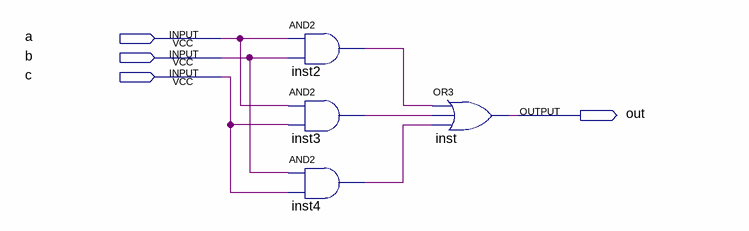
[diagram p0: schematic sheet]
// Quartus schematic maj3.bdf as structural Verilog: 4 symbols, 4 pins
module maj3 (
  input  a,
  input  b,
  input  c,
  output out
);

  wire inst2_out, inst3_out, inst4_out;

  and inst2 (inst2_out, a, b);
  and inst3 (inst3_out, a, c);
  and inst4 (inst4_out, b, c);
  or inst (out, inst2_out, inst3_out, inst4_out);
endmodule
